# EAGLE schematic charge_controller (EAGLE 9.5.1)
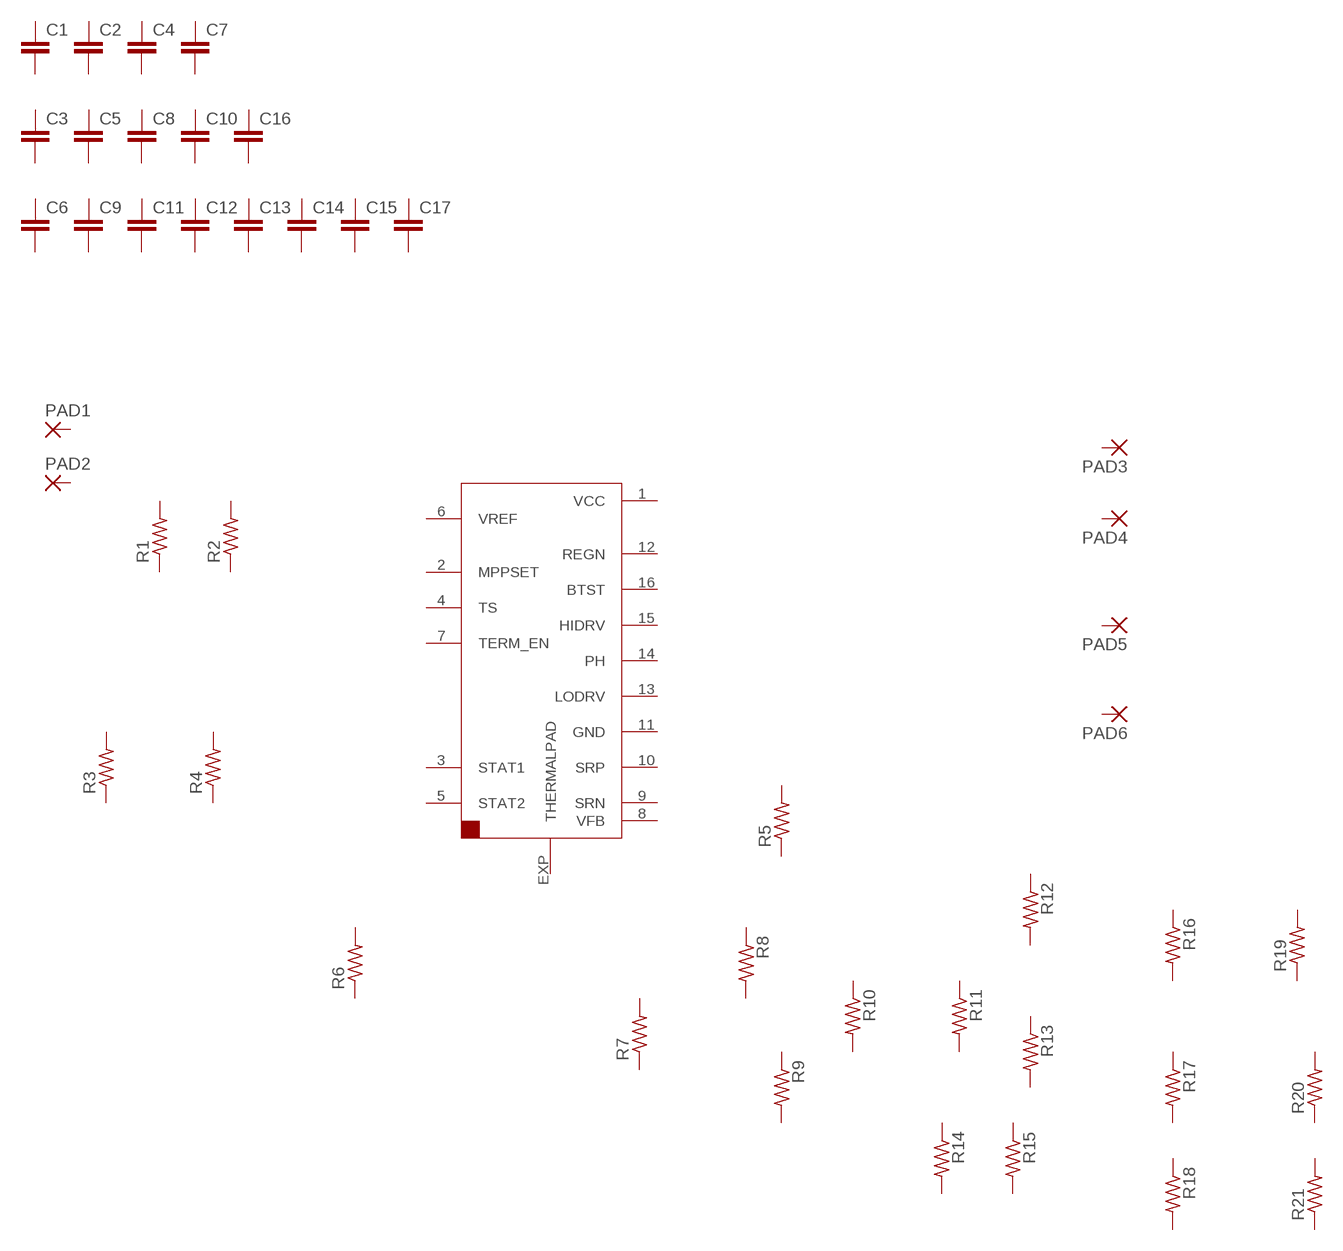
[diagram p0: schematic, sheet 1]

## Parts
C1  C-EUC1210  [C1210]
C2  C-EUC1210  [C1210]
C3  C-EUC0805  [C0805]
C4  C-EUC1206  [C1206]
C5  C-EUC0805  [C0805]
C6  C-EUC0603  [C0603]
C7  C-EUC1206  [C1206]
C8  C-EUC0805  [C0805]
C9  C-EUC0603  [C0603]
C10  C-EUC0805  [C0805]
C11  C-EUC0603  [C0603]
C12  C-EUC0603  [C0603]
C13  C-EUC0603  [C0603]
C14  C-EUC0603  [C0603]
C15  C-EUC0603  [C0603]
C16  C-EUC0805  [C0805]
C17  C-EUC0603  [C0603]
PAD1  3,81/1,3  [3,81/1,3]
PAD2  3,81/1,3  [3,81/1,3]
PAD3  3,81/1,3  [3,81/1,3]
PAD4  3,81/1,3  [3,81/1,3]
PAD5  3,81/1,3  [3,81/1,3]
PAD6  3,81/1,3  [3,81/1,3]
R1  R-US_R1206  [R1206]
R2  R-US_R1206  [R1206]
R3  R-US_R0805  [R0805]
R4  R-US_R0805  [R0805]
R5  R-US_R0603  [R0603]
R6  R-US_R1206  [R1206]
R7  R-US_R0603  [R0603]
R8  R-US_R0805  [R0805]
R9  R-US_R0603  [R0603]
R10  R-US_R0603  [R0603]
R11  R-US_R0603  [R0603]
R12  R-US_R0603  [R0603]
R13  R-US_R0603  [R0603]
R14  R-US_R0603  [R0603]
R15  R-US_R0603  [R0603]
R16  R-US_R0603  [R0603]
R17  R-US_R0603  [R0603]
R18  R-US_R0603  [R0603]
R19  R-US_R0805  [R0805]
R20  R-US_R0805  [R0805]
R21  R-US_R0805  [R0805]
U$1  BQ24650  [BQ24650]
Unconnected: C1.1 C1.2 C2.1 C2.2 C3.1 C3.2 C4.1 C4.2 C5.1 C5.2 C6.1 C6.2 C7.1 C7.2 C8.1 C8.2 C9.1 C9.2 C10.1 C10.2 C11.1 C11.2 C12.1 C12.2 C13.1 C13.2 C14.1 C14.2 C15.1 C15.2 C16.1 C16.2 C17.1 C17.2 PAD1.1(P) PAD2.1(P) PAD3.1(P) PAD4.1(P) PAD5.1(P) PAD6.1(P) R1.1 R1.2 R2.1 R2.2 R3.1 R3.2 R4.1 R4.2 R5.1 R5.2 R6.1 R6.2 R7.1 R7.2 R8.1 R8.2 R9.1 R9.2 R10.1 R10.2 R11.1 R11.2 R12.1 R12.2 R13.1 R13.2 R14.1 R14.2 R15.1 R15.2 R16.1 R16.2 R17.1 R17.2 R18.1 R18.2 R19.1 R19.2 R20.1 R20.2 R21.1 R21.2 U$1.1(VCC) U$1.2(MPPSET) U$1.3(STAT1) U$1.4(TS) U$1.5(STAT2) U$1.6(VREF) U$1.7(TERM_EN) U$1.8(VFB) U$1.9(SRN) U$1.10(SRP) U$1.11(GND) U$1.12(REGN) U$1.13(LODRV) U$1.14(PH) U$1.15(HIDRV) U$1.16(BTST) U$1.EXP(THERMALPAD)

## Library data of the parts
C1-C17 = rcl:C-EU: CAPACITOR, European symbol; SPICEPREFIX: C
PAD1-PAD6 = wirepad:3,81/1,3: THROUGH-HOLE PAD
R1-R21 = rcl:R-US_: RESISTOR, American symbol; SPICEPREFIX: R
U$1 = monitoring_board:BQ24650: Texas Instruments -- bq24650 Synchronous Switch-Mode Battery Charge Controller for Solar Power With Maximum Power Point Tracking